# EAGLE design sensor_board (EAGLE 9.6.2)
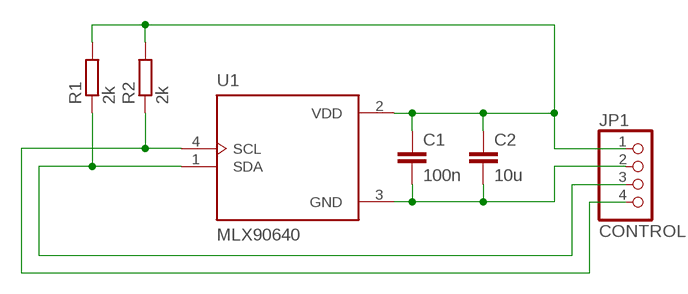
[diagram p0: schematic, sheet 1]

## Parts
C1  100n  C-EUC0805  [C0805]
C2  10u  C-EUC0805  [C0805]
JP1  CONTROL  PINHD-1X4  [1X04]
R1  2k  R-EU_R0805  [R0805]
R2  2k  R-EU_R0805  [R0805]
U1  MLX90640  MLX90640ESF-BAB-000-TU  [TO292P945H1165-4]

## Nets
GND: C1.2 C2.2 JP1.2 U1.3(GND)
SCL: JP1.4 R2.1 U1.4(SCL)
SDA: JP1.3 R1.1 U1.1(SDA)
VDD: C1.1 C2.1 JP1.1 R1.2 R2.2 U1.2(VDD)

## Library data of the parts
C1 C2 = resistor:C-EU: CAPACITOR, European symbol
JP1 = pinhead:PINHD-1X4: PIN HEADER
R1 R2 = resistor:R-EU_: RESISTOR, European symbol
U1 = MLX90640ESF-BAB-000-TU:MLX90640ESF-BAB-000-TU: SENSOR DGTL -40C-85C TO39 Check availability <https://pricing.snapeda.com/parts/MLX90640ESF-BAB-000-TU/Melexis%20Technologies%20NV/view-part?ref=eda>; AVAILABILITY: In Stock; DESCRIPTION: Thermal Image Sensor 32H x 24V - TO-39; MF: Melexis Technologies NV; MP: MLX90640ESF-BAB-000-TU; PACKAGE: TO-39 Melexis Technologies NV; PRICE: None; PURCHASE-URL: https://pricing.snapeda.com/search/part/MLX90640ESF-BAB-000-TU/?ref=eda

## Net classes
0 power: width 1.016 mm, drill 0.9 mm

## Board
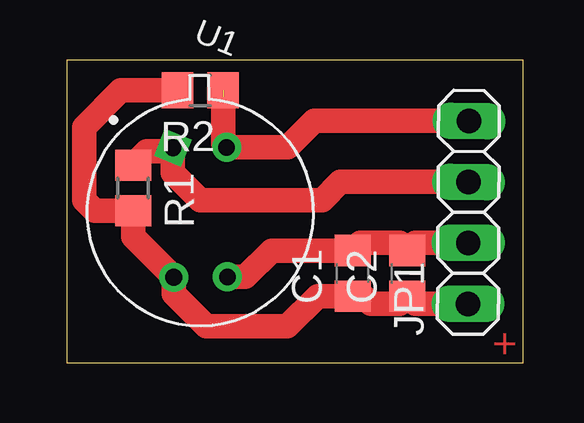
[diagram p1: board, top side]

Size 19.03 x 12.62 mm. Coordinates in mm from the lower left corner, seen from the top.
Outline: 19.03,12.62 0,12.62 0,0 19.03,0 19.03,12.62
Copper layers (1*16): Top 0.035mm / dielectric 1.5mm / Bottom 0.035mm
Design rules "default *": minimum track width 10mil, minimum drill 0.9mm, track to track 8mil, track to pad 8mil, pad to pad 8mil, via to via 8mil, smd to smd 8mil, copper to edge 40mil, drill to drill 8mil, minimum pad ring 10mil, minimum via ring 8mil, stop-mask expansion 4mil, vias tented up to drill 0mil, thermal gap 10mil

### Footprints (pad centres in the part's own frame; a part is rotated, then mirrored left to right if it is on the bottom)
C0805 = smd 1.3 x 1.5: 1 -0.95,0; 2 0.95,0
1X04 = drill 1.016 long: 1 -3.81,0; 2 -1.27,0; 3 1.27,0; 4 3.81,0
R0805 = smd 1.3 x 1.5: 1 -0.95,0; 2 0.95,0
TO292P945H1165-4 = drill 0.7 pad 1.1 square: 1 -2.065,2.067 | drill 0.7 pad 1.1: 2 0,-2.92; 3 2.065,-2.065; 4 0,2.92

### Placement (x,y rotation side)
C1  11.92,3.73 90 top
C2  14.2,3.73 90 top
JP1  16.74,6.27 89.7 top
R1  2.77,7.29 270 top
R2  5.57,11.35 180 top
U1  5.57,6.27 337.9 top

### Tracks (layer width: path | path; a pad name or v marks a point on that pad's centre or on a via)
GND
  Top 1.016: JP1.2 14.52,5 C2.2 13.88,5 12.24,5 C1.2 8.55,4.68 7.45,3.58 U1.3
SCL  (1 unrouted)
  Top 1.016: 6.52,11.1 6.67,10.95 | JP1.4 10.31,10.08 9.21,8.98 U1.4 6.52,9.13 R2.1
SDA
  Top 1.016: U1.1 4.43,8.81 | 4.43,8.81 4.43,7.92 5.57,6.78 10.65,6.78 11.41,7.54 JP1.3 | JP1.3 | R1.1 3.35,8.81 4.43,8.81
VDD
  Top 1.016: JP1.1 14.52,2.46 C2.1 13.88,2.46 12.68,2.46 12.36,2.78 C1.1 10.46,2.78 9.2,1.52 5.82,1.52 4.47,2.88 U1.2 2.77,5.26 R1.2 1.18,6.34 0.74,6.78 0.74,9.83 2.27,11.35 R2.2

### Text on the board
Top: +